# EAGLE design diode (EAGLE 7.3.0)
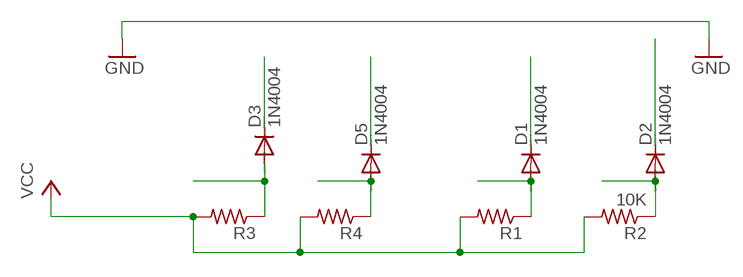
[diagram p0: schematic, sheet 1]

## Parts
D1  1N4004  [DO41-10]
D2  1N4004  [DO41-10]
D3  1N4004  [DO41-10]
D5  1N4004  [DO41-10]
R1  R-US_0204/5  [0204/5]
R2  10K  R-US_0204/5  [0204/5]
R3  R-US_0204/5  [0204/5]
R4  R-US_0204/5  [0204/5]

## Nets
IN1: D3.C
IN2: D5.C
IN3: D1.C
IN4: D2.C
OUT1: D3.A R3.1
OUT2: D5.A R4.1
OUT3: D1.A R1.1
OUT4: D2.A R2.1
VCC: R1.2 R2.2 R3.2 R4.2

## Library data of the parts
D1-D3 D5 = diode:1N4004: DIODE general purpose rectifier, 1 A
R1-R4 = resistor:R-US_: RESISTOR, American symbol

## Board
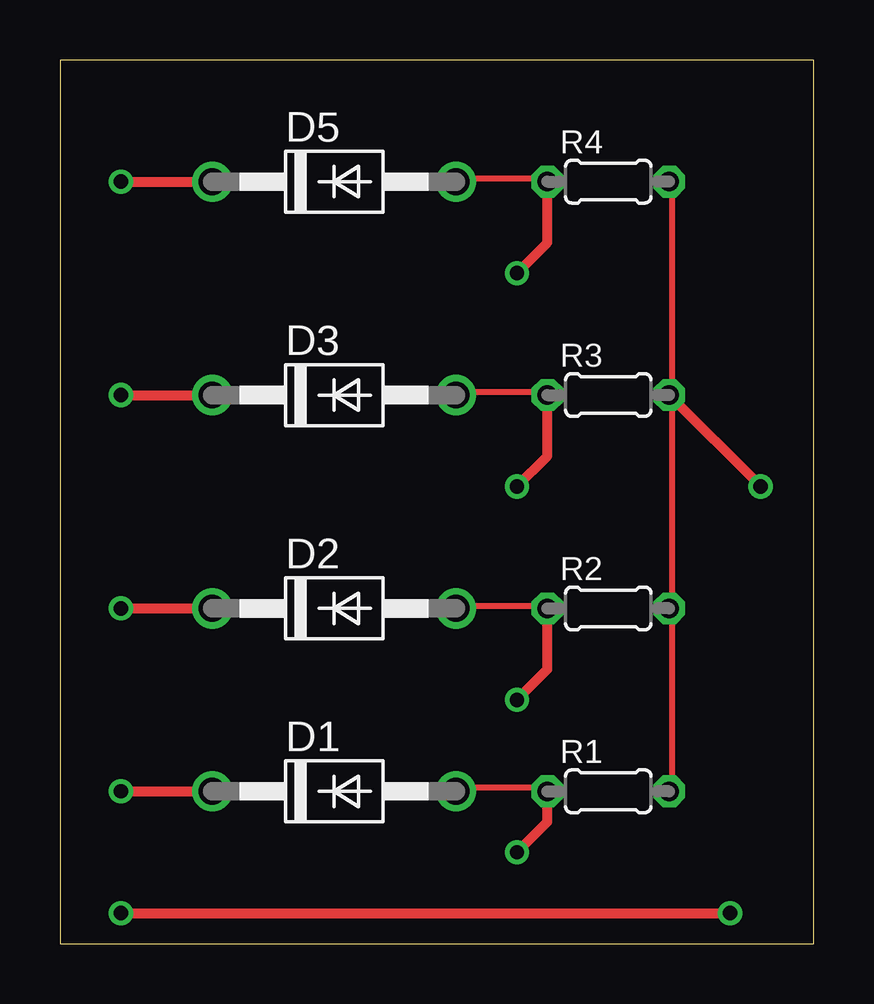
[diagram p1: board, top side]

Size 31.42 x 36.82 mm. Coordinates in mm from the lower left corner, seen from the top.
Outline: 0,0 31.42,0 31.42,36.82 0,36.82 0,0
Copper layers (1*16): Top 0.035mm / dielectric 1.5mm / Bottom 0.035mm
Design rules "default": minimum track width 10mil, minimum drill 24mil, track to track 8mil, track to pad 8mil, pad to pad 8mil, via to via 8mil, smd to smd 8mil, copper to edge 40mil, drill to drill 8mil, minimum pad ring 10mil, minimum via ring 8mil, stop-mask expansion 4mil, vias tented up to drill 0mil, thermal gap 10mil

### Footprints (pad centres in the part's own frame; a part is rotated, then mirrored left to right if it is on the bottom)
DO41-10 = drill 1.118: A 5.08,0; C -5.08,0
0204/5 = drill 0.813 octagon: 1 -2.54,0; 2 2.54,0

### Placement (x,y rotation side)
D1  11.43,6.35 0 top
D2  11.43,13.97 0 top
D3  11.43,22.86 0 top
D5  11.43,31.75 0 top
R1  22.86,6.35 0 top
R2  22.86,13.97 0 top
R3  22.86,22.86 0 top
R4  22.86,31.75 0 top

### Tracks (layer width: path | path; a pad name or v marks a point on that pad's centre or on a via)
GND  (via drill 0.6)
  Top 0.406: v2.54,1.27 v27.94,1.27
IN1  (via drill 0.6)
  Top 0.406: v2.54,22.86 D3.C
IN2  (via drill 0.6)
  Top 0.406: v2.54,31.75 D5.C
IN3  (via drill 0.6)
  Top 0.406: v2.54,6.35 D1.C
IN4  (via drill 0.6)
  Top 0.406: v2.54,13.97 D2.C
OUT1  (via drill 0.6)
  Top 0.254: R3.1 20.24,22.99 16.59,22.99 D3.A
  Top 0.406: v19.05,19.05 20.32,20.32 R3.1
OUT2  (via drill 0.6)
  Top 0.254: R4.1 20.24,31.9 16.59,31.9 D5.A
  Top 0.406: v19.05,27.94 20.32,29.21 R4.1
OUT3  (via drill 0.6)
  Top 0.254: R1.1 20.24,6.53 16.59,6.53 D1.A
  Top 0.406: v19.05,3.81 20.32,5.08 R1.1
OUT4  (via drill 0.6)
  Top 0.254: R2.1 20.24,14.07 16.59,14.07 D2.A
  Top 0.406: v19.05,10.16 20.32,11.43 R2.1
VCC  (via drill 0.6)
  Top 0.254: R1.2 25.5,6.53 25.5,13.84 R2.2 25.5,14.07 25.5,22.76 R3.2 25.5,22.99 25.5,31.67 R4.2
  Top 0.406: v29.21,19.05 R3.2